# EAGLE design RH031.1 (EAGLE 7.1.0)
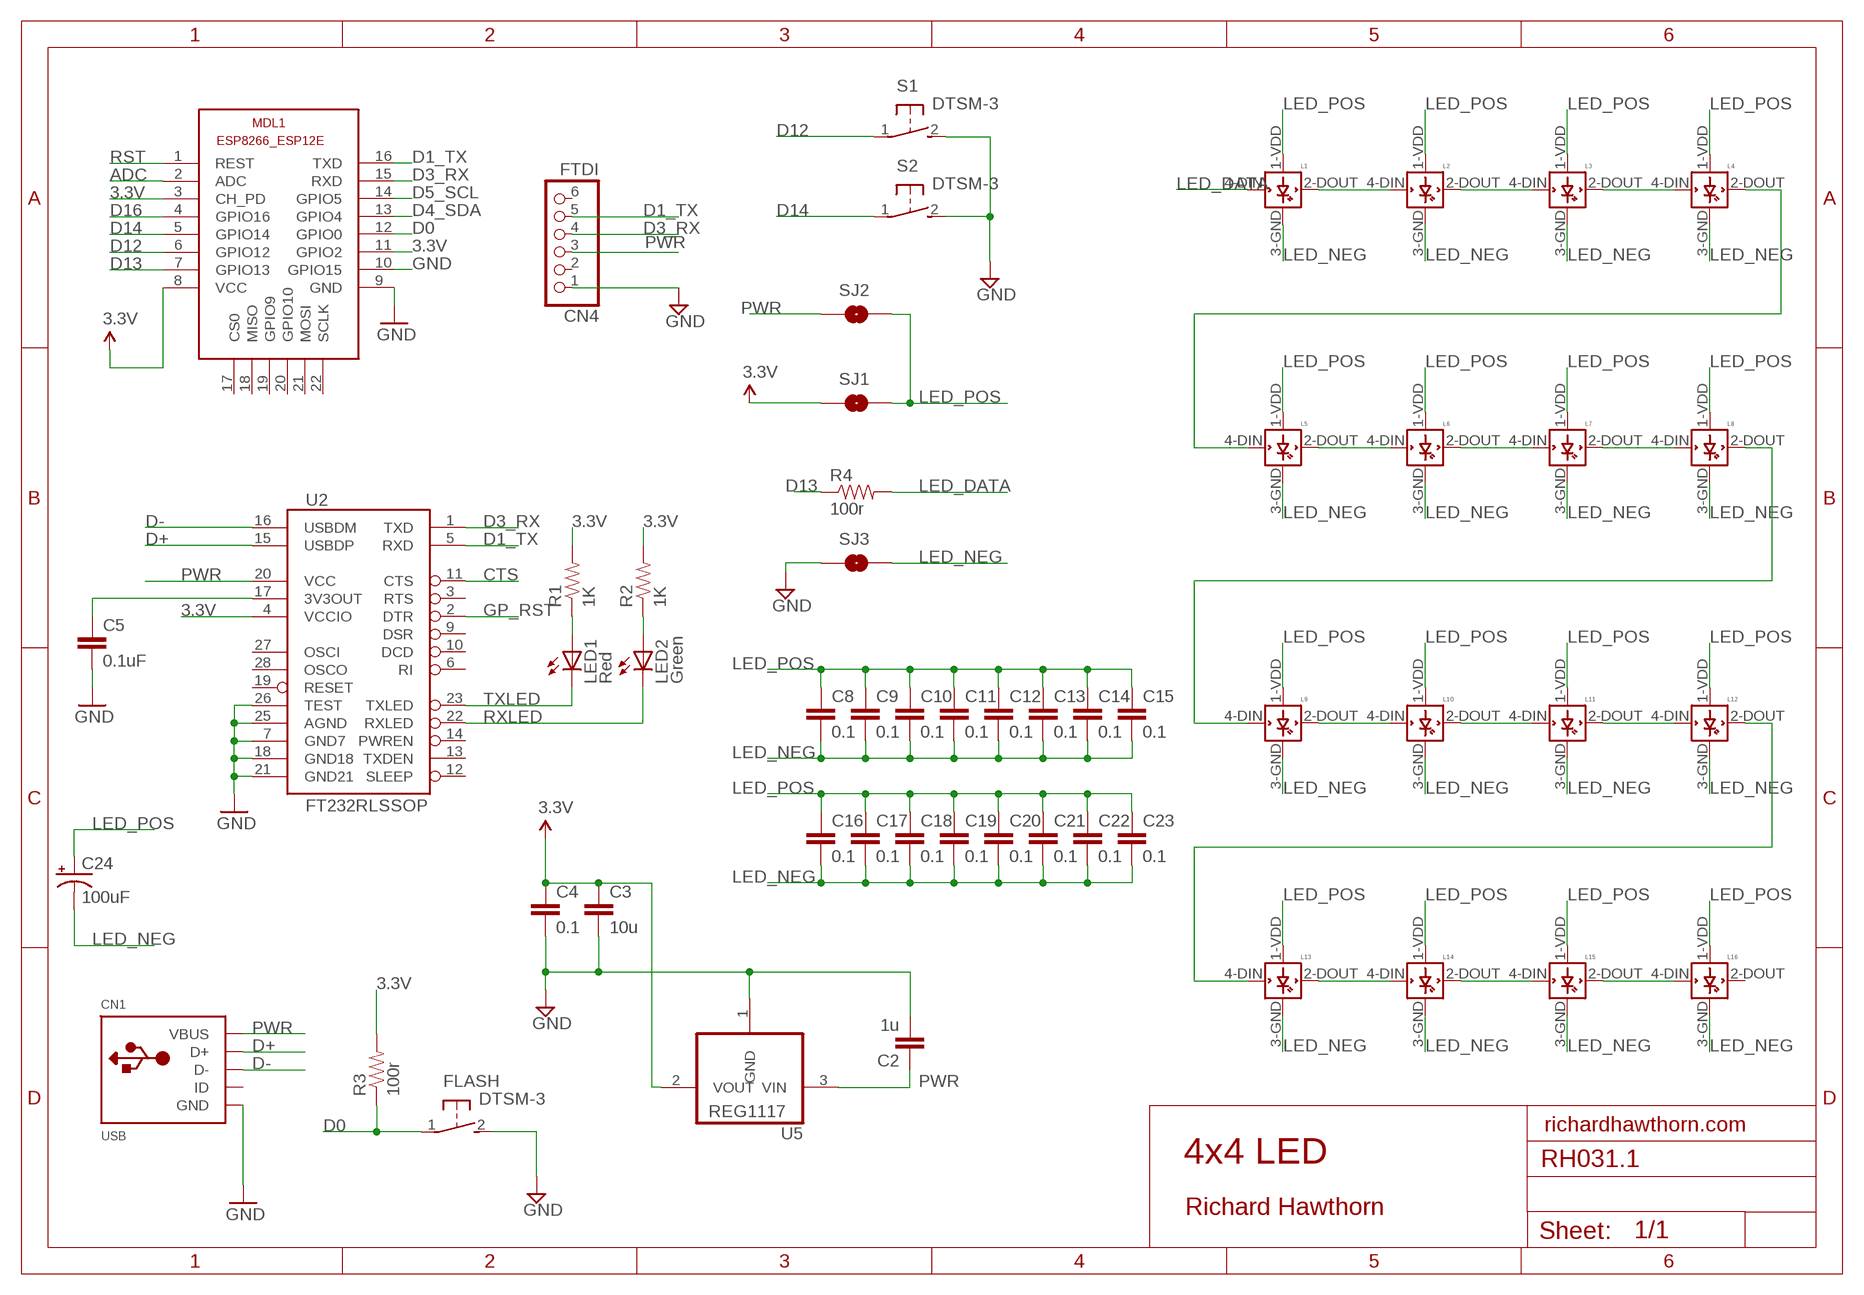
[diagram p0: schematic, sheet 1]

## Parts
C2  1u  CAP0603-CAP  [0603-CAP]
C3  10u  CAP0805-CAP  [0805-CAP]
C4  0.1  CAP0603-CAP  [0603-CAP]
C5  0.1uF  CAP0805  [0805]
C8  0.1  CAP0603-CAP  [0603-CAP]
C9  0.1  CAP0603-CAP  [0603-CAP]
C10  0.1  CAP0603-CAP  [0603-CAP]
C11  0.1  CAP0603-CAP  [0603-CAP]
C12  0.1  CAP0603-CAP  [0603-CAP]
C13  0.1  CAP0603-CAP  [0603-CAP]
C14  0.1  CAP0603-CAP  [0603-CAP]
C15  0.1  CAP0603-CAP  [0603-CAP]
C16  0.1  CAP0603-CAP  [0603-CAP]
C17  0.1  CAP0603-CAP  [0603-CAP]
C18  0.1  CAP0603-CAP  [0603-CAP]
C19  0.1  CAP0603-CAP  [0603-CAP]
C20  0.1  CAP0603-CAP  [0603-CAP]
C21  0.1  CAP0603-CAP  [0603-CAP]
C22  0.1  CAP0603-CAP  [0603-CAP]
C23  0.1  CAP0603-CAP  [0603-CAP]
C24  100uF  100UF-10V-10%(TANT)  [EIA7343]
CN1  USB  USBMINIB  [USB-MINIB]
CN4  FTDI  PINHD-1X6  [1X06]
FLASH  DTSM-3  [DTSM-3]
L1  WS2812B  [WS2812B]
L2  WS2812B  [WS2812B]
L3  WS2812B  [WS2812B]
L4  WS2812B  [WS2812B]
L5  WS2812B  [WS2812B]
L6  WS2812B  [WS2812B]
L7  WS2812B  [WS2812B]
L8  WS2812B  [WS2812B]
L9  WS2812B  [WS2812B]
L10  WS2812B  [WS2812B]
L11  WS2812B  [WS2812B]
L12  WS2812B  [WS2812B]
L13  WS2812B  [WS2812B]
L14  WS2812B  [WS2812B]
L15  WS2812B  [WS2812B]
L16  WS2812B  [WS2812B]
LED1  Red  LEDCHIPLED_0805  [CHIPLED_0805]
LED2  Green  LEDCHIPLED_0805  [CHIPLED_0805]
MDL1  ESP8266-12EESP8266-ESP12E  [ESP8266-ESP12E]
R1  1K  RESISTOR0805-RES  [0805]
R2  1K  RESISTOR0805-RES  [0805]
R3  100r  RESISTOR0603-RES  [0603-RES]
R4  100r  RESISTOR0603-RES  [0603-RES]
S1  DTSM-3  [DTSM-3]
S2  DTSM-3  [DTSM-3]
SJ1  SOLDERJUMPERNO  [SJ_2S-NO]
SJ2  SOLDERJUMPERNO  [SJ_2S-NO]
SJ3  SOLDERJUMPERNO  [SJ_2S-NO]
U2  FT232RLSSOP  [SSOP28DB]
U5  REG1117  [SOT223]

## Nets
3.3V: C3.1 C4.1 MDL1.3(CH_PD) MDL1.8(VCC) MDL1.11(GPIO2) R1.2 R2.2 R3.2 SJ1.1 U2.4(VCCIO) U5.2(VOUT)
3.3VOUT: C5.1 U2.17(3V3OUT)
ADC: MDL1.2(ADC)
CTS: U2.11(CTS)
D0: FLASH.1 MDL1.12(GPIO0) R3.1
D1_TX: CN4.5 MDL1.16(TXD) U2.5(RXD)
D3_RX: CN4.4 MDL1.15(RXD) U2.1(TXD)
D4_SDA: MDL1.13(GPIO4)
D5_SCL: MDL1.14(GPIO5)
D12: MDL1.6(GPIO12) S1.1
D13: MDL1.7(GPIO13) R4.1
D14: MDL1.5(GPIO14) S2.1
D16: MDL1.4(GPIO16)
D+: CN1.D+ U2.15(USBDP)
D-: CN1.D- U2.16(USBDM)
GND [power]: C2.2 C3.2 C4.2 C5.2 CN1.GND CN4.1 FLASH.2 MDL1.9(GND) MDL1.10(GPIO15) S1.2 S2.2 SJ3.1 U2.7(GND7) U2.18(GND18) U2.21(GND21) U2.25(AGND) U2.26(TEST) U5.1(GND)
GP_RST: U2.2(DTR)
LED-MID-1: L5.2-DOUT(DOUT) L6.4-DIN(DIN)
LED-MID-2: L7.2-DOUT(DOUT) L8.4-DIN(DIN)
LED-MID-3: L9.2-DOUT(DOUT) L10.4-DIN(DIN)
LED-OUT-1: L1.2-DOUT(DOUT) L2.4-DIN(DIN)
LED-OUT-2: L3.2-DOUT(DOUT) L4.4-DIN(DIN)
LED-OUT-3: L4.2-DOUT(DOUT) L5.4-DIN(DIN)
LED-OUT-4: L12.2-DOUT(DOUT) L13.4-DIN(DIN)
LED-OUT-5: L13.2-DOUT(DOUT) L14.4-DIN(DIN)
LED-OUT-6: L15.2-DOUT(DOUT) L16.4-DIN(DIN)
LED_DATA: L1.4-DIN(DIN) R4.2
LED_NEG [power]: C8.2 C9.2 C10.2 C11.2 C12.2 C13.2 C14.2 C15.2 C16.2 C17.2 C18.2 C19.2 C20.2 C21.2 C22.2 C23.2 C24.C(-) L1.3-GND(GND) L2.3-GND(GND) L3.3-GND(GND) L4.3-GND(GND) L5.3-GND(GND) L6.3-GND(GND) L7.3-GND(GND) L8.3-GND(GND) L9.3-GND(GND) L10.3-GND(GND) L11.3-GND(GND) L12.3-GND(GND) L13.3-GND(GND) L14.3-GND(GND) L15.3-GND(GND) L16.3-GND(GND) SJ3.2
LED_POS [power]: C8.1 C9.1 C10.1 C11.1 C12.1 C13.1 C14.1 C15.1 C16.1 C17.1 C18.1 C19.1 C20.1 C21.1 C22.1 C23.1 C24.A(+) L1.1-VDD(VDD) L2.1-VDD(VDD) L3.1-VDD(VDD) L4.1-VDD(VDD) L5.1-VDD(VDD) L6.1-VDD(VDD) L7.1-VDD(VDD) L8.1-VDD(VDD) L9.1-VDD(VDD) L10.1-VDD(VDD) L11.1-VDD(VDD) L12.1-VDD(VDD) L13.1-VDD(VDD) L14.1-VDD(VDD) L15.1-VDD(VDD) L16.1-VDD(VDD) SJ1.2 SJ2.2
N$2: LED1.A R1.1
N$3: LED2.A R2.1
N$6: L2.2-DOUT(DOUT) L3.4-DIN(DIN)
N$10: L6.2-DOUT(DOUT) L7.4-DIN(DIN)
N$12: L8.2-DOUT(DOUT) L9.4-DIN(DIN)
N$14: L10.2-DOUT(DOUT) L11.4-DIN(DIN)
N$15: L11.2-DOUT(DOUT) L12.4-DIN(DIN)
N$18: L14.2-DOUT(DOUT) L15.4-DIN(DIN)
PWR [power]: C2.1 CN1.VBUS CN4.3 SJ2.1 U2.20(VCC) U5.3(VIN)
RST: MDL1.1(REST)
RXLED: LED2.C U2.22(RXLED)
TXLED: LED1.C U2.23(TXLED)
Unconnected: CN1.ID CN4.2 CN4.6 L16.2-DOUT(DOUT) MDL1.17(CS0) MDL1.18(MISO) MDL1.19(GPIO9) MDL1.20(GPIO10) MDL1.21(MOSI) MDL1.22(SCLK) U2.3(RTS) U2.6(RI) U2.9(DSR) U2.10(DCD) U2.12(SLEEP) U2.13(TXDEN) U2.14(PWREN) U2.19(RESET) U2.27(OSCI) U2.28(OSCO)

## Notes on the sheet
- richardhawthorn.com
- 4x4 LED
- Richard Hawthorn

## Library data of the parts
C2-C4 C8-C23 = LowPowerLab:CAP: Capacitor Standard 0603 ceramic capacitor, and 0.1" leaded capacitor.
C5 = SparkFun:CAP: Capacitor Standard 0603 ceramic capacitor, and 0.1" leaded capacitor.
C24 = SparkFun-Capacitors:100UF-10V-10%(TANT): CAP-07890; PROD_ID: CAP-07890
CN1 = LowPowerLab:USB: USB Connectors USBMINIB - Surface Mount Female Mini-B USB Connector 4UConnector: 06564 By microbuilder.eu Thru-hole RA Female Mini-B USB Connector 4UConnector: 18732 By ladyada.net
CN4 = pinhead:PINHD-1X6: PIN HEADER
FLASH S1 S2 = switch-tact:DTSM-3
L1-L16 = adafruit:WS2812B
LED1 LED2 = led:LED: LED OSRAM: - CHIPLED LG R971, LG N971, LY N971, LG Q971, LY Q971, LO R971, LY R971 LH N974, LH R974 LS Q976, LO Q976, LY Q976 LO Q996 - Hyper CHIPLED LW Q18S LB Q993, LB Q99A, LB R99A - SideLED LS A670, LO A670, LY A670, LG A670, LP A670 LB A673, LV A673, LT A673, LW A673 LH A674 LY A675 LS A676, LA A676, LO A676, LY A676, LW A676 LS A679, LY A679, LG A679 - Hyper Micro SIDELED® LS Y876, LA Y876, LO Y876, LY Y876 LT Y87S - SmartLED LW L88C, LW L88S LB L89C, LB L89S, LG L890 LS L89K, LO L89K, LY L89K LS L896, LA L896, LO L896, LY L896 - TOPLED LS T670, LO T670, LY T670, LG T670, LP T670 LSG T670, LSP T670, LSY T670, LOP T670, LYG T670 LG T671, LOG T671, LSG T671 LB T673, LV T673, LT T673, LW T673 LH T674 LS T676, LA T676, LO T676, LY T676, LB T676, LH T676, LSB T676, LW T676 LB T67C, LV T67C, LT T67C, LS T67K, LO T67K, LY T67K, LW E67C LS E67B, LA E67B, LO E67B, LY E67B, LB E67C, LV E67C, LT E67C LW T67C LS T679, LY T679, LG T679 LS T770, LO T770, LY T770, LG T770, LP T770 LB T773, LV T773, LT T773, LW T773 LH T774 LS E675, LA E675, LY E675, LS T675 LS T776, LA T776, LO T776, LY T776, LB T776 LHGB T686 LT T68C, LB T68C - Hyper Mini TOPLED® LB M676 - Mini TOPLED Santana® LG M470 LS M47K, LO M47K, LY M47K Source: http://www.osram.convergy.de LUXEON: - LUMILED® LXK2-PW12-R00, LXK2-PW12-S00, LXK2-PW14-U00, LXK2-PW14-V00 LXK2-PM12-R00, LXK2-PM12-S00, LXK2-PM14-U00 LXK2-PE12-Q00, LXK2-PE12-R00, LXK2-PE12-S00, LXK2-PE14-T00, LXK2-PE14-U00 LXK2-PB12-K00, LXK2-PB12-L00, LXK2-PB12-M00, LXK2-PB14-N00, LXK2-PB14-P00, LXK2-PB14-Q00 LXK2-PR12-L00, LXK2-PR12-M00, LXK2-PR14-Q00, LXK2-PR14-R00 LXK2-PD12-Q00, LXK2-PD12-R00, LXK2-PD12-S00 LXK2-PH12-R00, LXK2-PH12-S00 LXK2-PL12-P00, LXK2-PL12-Q00, LXK2-PL12-R00 Source: www.luxeon.com KINGBRIGHT: KA-3528ASYC Source: www.kingbright.com
MDL1 = ESP8266-ESP12E:ESP8266-12E: ESP8266-12E with additional I/O and GPIO04/05 corrected The author cannot warrant that this library is free from error or will meet your specific requirements. Created by PuceBaboon.com. Komagane, Nagano, JAPAN
R1 R2 = SparkFun:RESISTOR: Resistor Basic schematic elements and footprints for 0603, 1206, and PTH resistors.
R3 R4 = LowPowerLab:RESISTOR: Resistor Basic schematic elements and footprints for 0603, 1206, and PTH resistors.
SJ1-SJ3 = SparkFun-Retired:SOLDERJUMPER: Solder Jumper Standard SMD solder jumper. Used to automate production. Two varients : Normally Open and Normally Closed are the same, but have different paste layers. NC will have a large amount of paste and should jumper during reflow.
U2 = SparkFun:FT232RL: USB UART FT232RL 4th Generation USB UART (USB <-> Serial) Controller. Spark Fun Electronics SKU : COM-00650
U5 = burr-brown:REG1117: 800mA and 1A Low Dropout (LDO) Positive Regulator 1.8V, 2.5V, 2.85V, 3.3V, 5V, and Adj; MPN: REG1117; OC_FARNELL: 1097566; OC_NEWARK: 14P6981

## Net classes
1 power: width 0.381 mm, clearance 0.254 mm

## Board
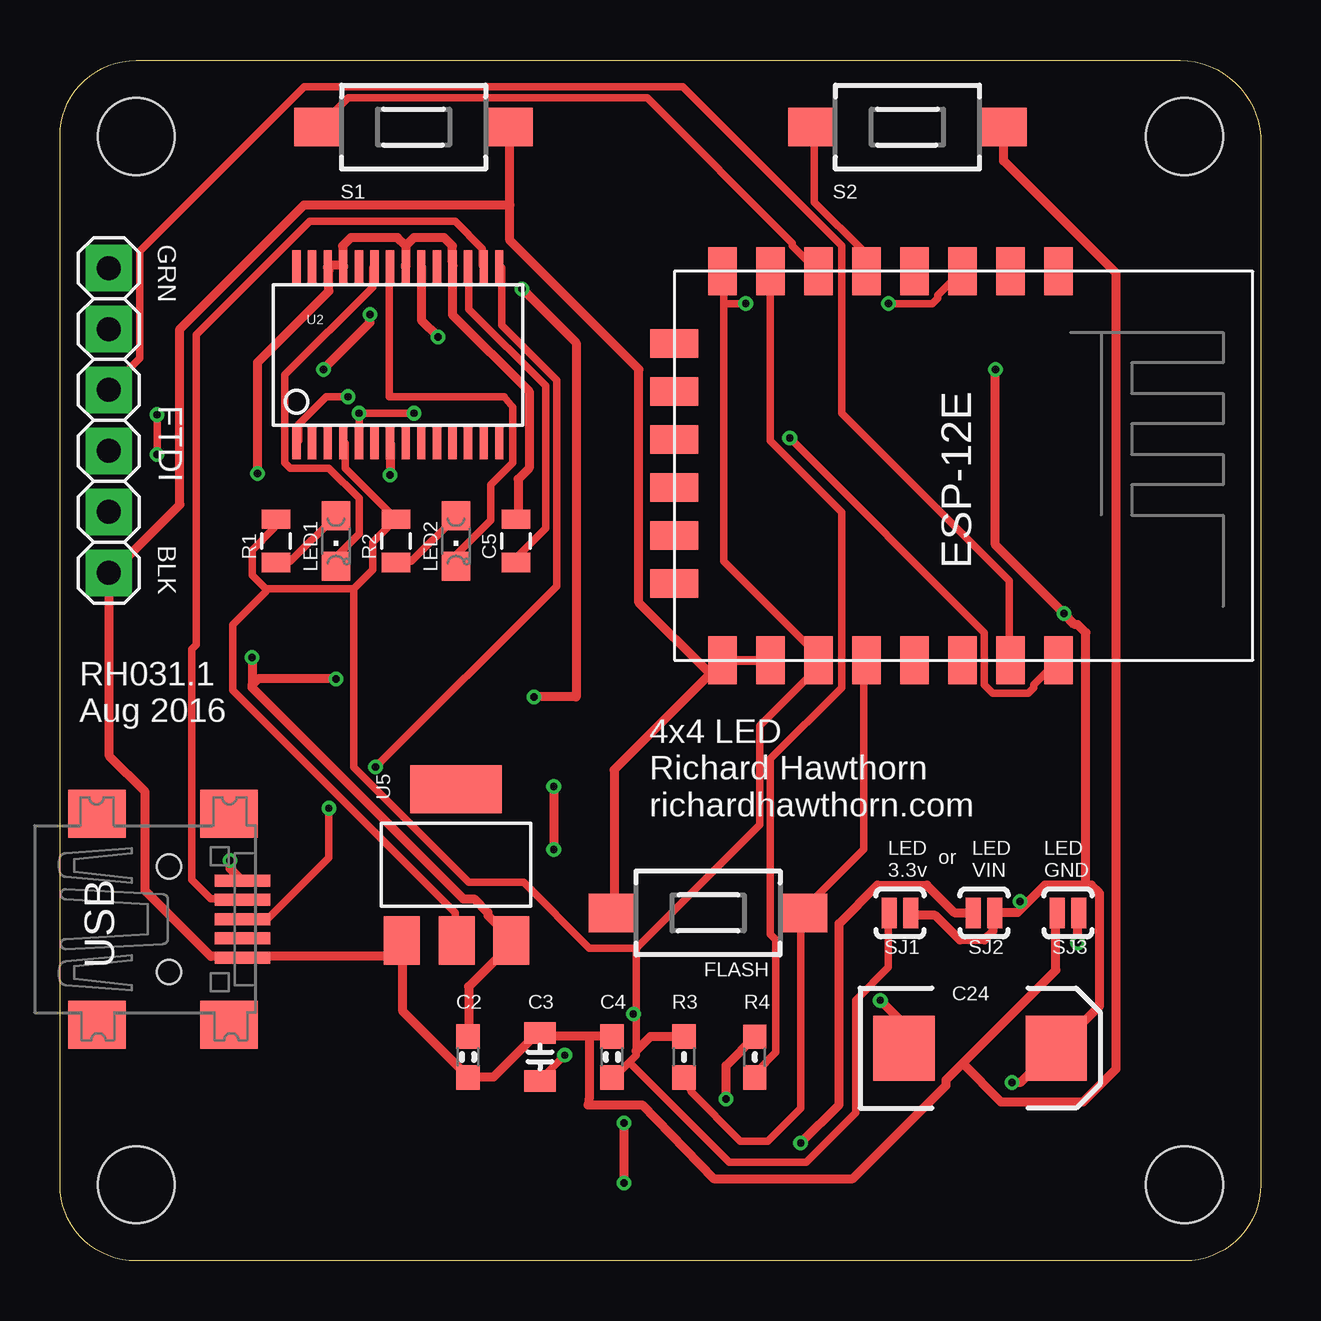
[diagram p1: board, top side]
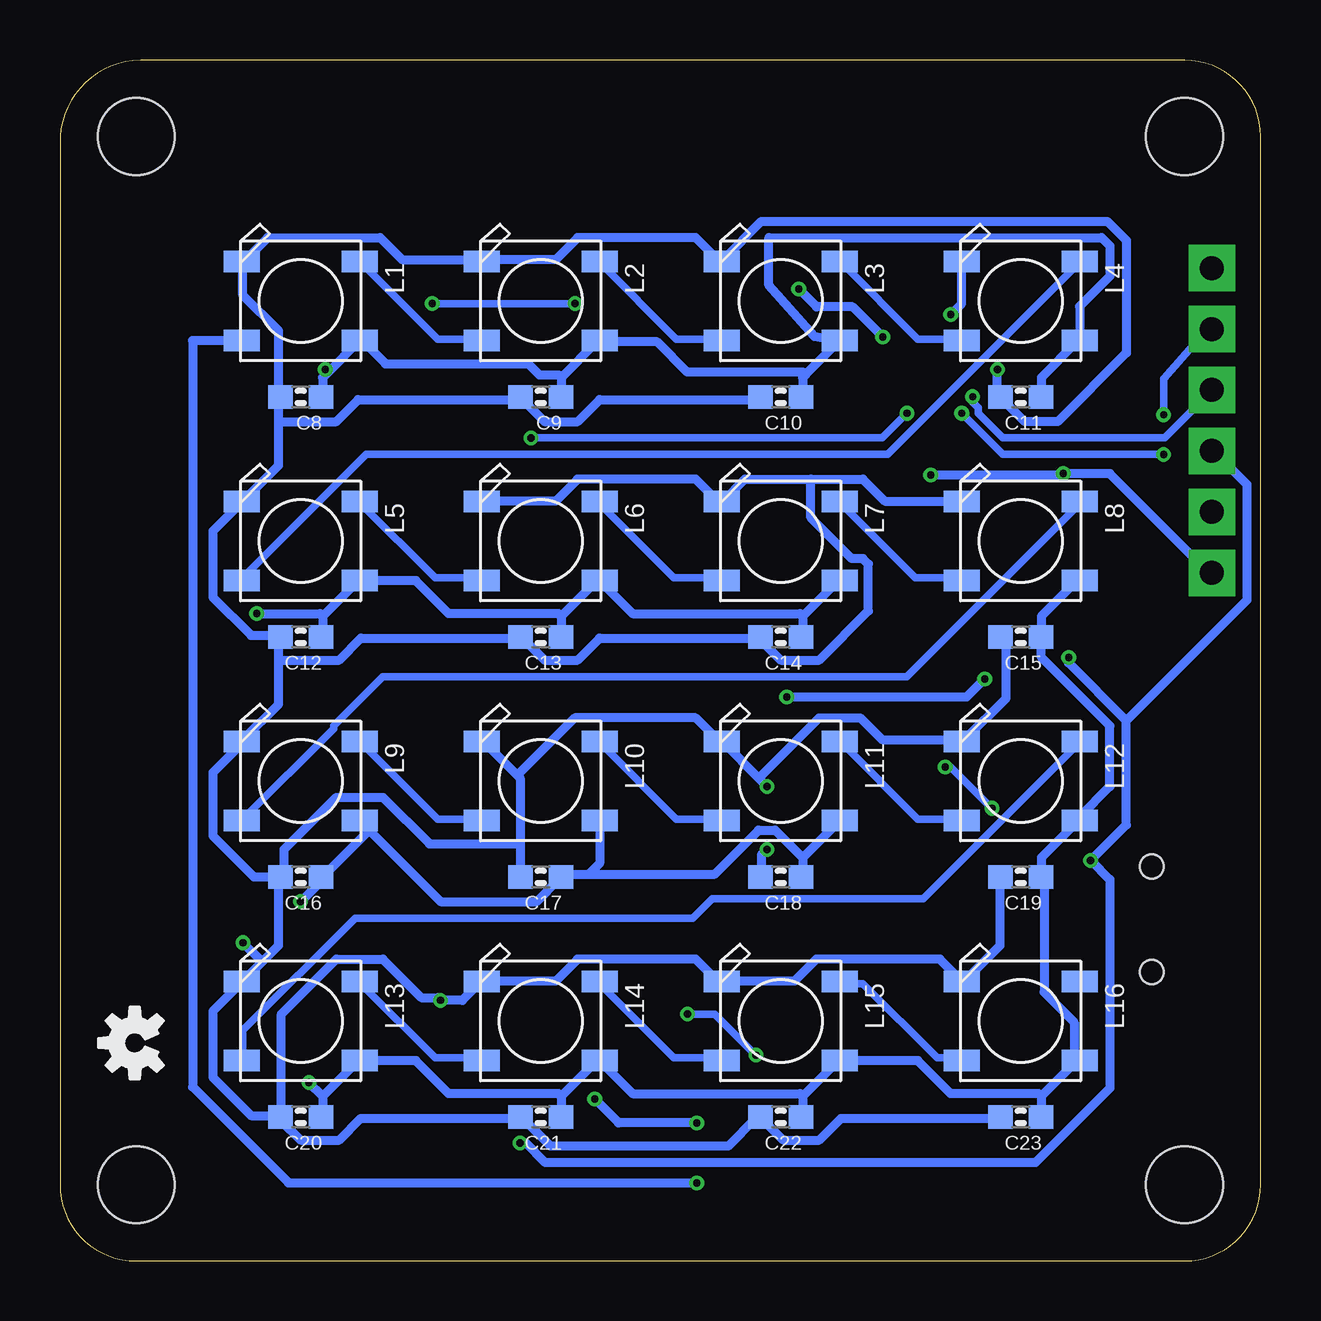
[diagram p2: board, bottom side, seen from below]

Size 50.03 x 50.04 mm. Coordinates in mm from the lower left corner, seen from the top.
Outline: 46.85,0 3.17,0 arc-90 0,3.17 0,46.85 arc-90 3.17,50.03 46.35,50.03 arc-90 50.03,46.85 50.03,3.17 arc-90 46.85,0
Copper layers (1*16): Top 0.035mm / dielectric 1.5mm / Bottom 0.035mm
Design rules "ITEADstudio_DRC *": minimum track width 12mil, minimum drill 12mil, track to track 6mil, track to pad 6mil, pad to pad 6mil, via to via 6mil, smd to smd 0mil, copper to edge 10mil, drill to drill 10mil, minimum pad ring 10mil, minimum via ring 6mil, stop-mask expansion 2mil, vias tented up to drill 100mil, thermal gap 15mil
Holes 3.2 mm at 3.17,3.17 46.85,3.17 3.17,46.85 46.85,46.85
tKeepout: area 0,44.3 to 5.7,50; area 44.3,25 to 50,50; area 44.3,0 to 50,5.7; area 0,0 to 5.7,5.7
bKeepout: area 0,0 to 5.7,5.7; area 0,44.3 to 5.7,50; area 44.3,25 to 50,50; area 44.3,0 to 50,5.7
tRestrict: area 24.3,8.9 to 29.1,12.8; area 5.8,16.9 to 6.9,18.5; area 5.2,9.7 to 6.7,10.4
bRestrict: area 27.4,17.7 to 29.2,18.7; area 21.1,13.8 to 22.9,14.9; area 21.6,12.6 to 22.1,13.2; area 20.7,12.6 to 21.2,13.2; area 20.2,12.8 to 20.7,13.5; area 20.1,13.4 to 20.6,14; area 26.5,18.9 to 27.1,19.5; area 26.5,17.9 to 27.1,18.5; area 27.5,19.1 to 28,19.8; area 27.9,18.8 to 29.1,19.6

### Footprints (pad centres in the part's own frame; a part is rotated, then mirrored left to right if it is on the bottom)
0603-CAP = smd 1.016 x 0.965: 1 -0.85,0; 2 0.85,0
0805-CAP = smd 0.902 x 1.3: 1 -1,0; 2 1,0
0805 = smd 0.8 x 1.2: 1 -0.9,0; 2 0.9,0
EIA7343 = smd 2.55 x 2.7: A 3.17,0; C -3.17,0
USB-MINIB = smd 0.5 x 2.308: D+ 0,4.064; D- -0.8,4.064; GND 1.6,4.064; ID 0.8,4.064; VBUS -1.6,4.064 | smd 2 x 2.4: GND1 -4.4,-2; GND2 -4.4,3.5; GND3 4.4,3.5; GND4 4.4,-2 | hole 1: -2.2,1; 2.2,1
1X06 = drill 1 pad 1.93 square: 1 -6.35,0; 2 -3.81,0; 3 -1.27,0; 4 1.27,0; 5 3.81,0; 6 6.35,0
DTSM-3 = smd 2 x 1.6: 1 -3.97,0; 2 3.97,0
WS2812B = smd 1.5 x 0.9: 1-VDD 2.45,-1.65; 2-DOUT 2.45,1.65; 3-GND -2.45,1.65; 4-DIN -2.45,-1.65
CHIPLED_0805 = smd 1.2 x 1.2: A 0,-1.05; C 0,1.05
ESP8266-ESP12E = smd 2 x 1.2: 1 0,16; 2 0,14; 3 0,12; 4 0,10; 5 0,8; 6 0,6; 7 0,4; 8 0,2; 9 16.2,2; 10 16.2,4; 11 16.2,6; 12 16.2,8; 13 16.2,10; 14 16.2,12; 15 16.2,14; 16 16.2,16 | smd 1.2 x 2: 17 11,0; 18 3,0; 19 5,0; 20 13,0; 21 7,0; 22 9,0
0603-RES = smd 1.016 x 0.965: 1 -0.85,0; 2 0.85,0
SJ_2S-NO = smd 0.635 x 1.27: 1 -0.45,0; 2 0.45,0
SSOP28DB = smd 0.348 x 1.397: 1 -4.225,-3.656; 2 -3.575,-3.656; 3 -2.925,-3.656; 4 -2.275,-3.656; 5 -1.625,-3.656; 6 -0.975,-3.656; 7 -0.325,-3.656; 8 0.325,-3.656; 9 0.975,-3.656; 10 1.625,-3.656; 11 2.275,-3.656; 12 2.925,-3.656; 13 3.575,-3.656; 14 4.225,-3.656; 15 4.225,3.656; 16 3.575,3.656; 17 2.925,3.656; 18 2.275,3.656; 19 1.625,3.656; 20 0.975,3.656; 21 0.325,3.656; 22 -0.325,3.656; 23 -0.975,3.656; 24 -1.625,3.656; 25 -2.275,3.656; 26 -2.925,3.656; 27 -3.575,3.656; 28 -4.225,3.656
SOT223 = smd 1.499 x 2.007: 1 -2.261,-3.15; 2 0.025,-3.15; 3 2.311,-3.15 | smd 3.81 x 2.007: 4 0,3.15

### Placement (x,y rotation side)
C2  17,8.5 270 top
C3  20,8.5 90 top
C4  23,8.5 90 top
C5  19,30 90 top
C8  40,36 180 bottom
C9  30,36 180 bottom
C10  20,36 180 bottom
C11  10,36 180 bottom
C12  40,26 180 bottom
C13  30,26 180 bottom
C14  20,26 180 bottom
C15  10,26 180 bottom
C16  40,16 180 bottom
C17  30,16 180 bottom
C18  20,16 180 bottom
C19  10,16 180 bottom
C20  40,6 180 bottom
C21  30,6 180 bottom
C22  20,6 180 bottom
C23  10,6 180 bottom
C24  38.34,8.86 0 top
CN1  3.54,14.24 270 top
CN4  2.03,35.02 90 top
FLASH  27,14.5 180 top
L1  40,40 0 bottom
L2  30,40 0 bottom
L3  20,40 0 bottom
L4  10,40 0 bottom
L5  40,30 0 bottom
L6  30,30 0 bottom
L7  20,30 0 bottom
L8  10,30 0 bottom
L9  40,20 0 bottom
L10  30,20 0 bottom
L11  20,20 0 bottom
L12  10,20 0 bottom
L13  40,10 0 bottom
L14  30,10 0 bottom
L15  20,10 0 bottom
L16  10,10 0 bottom
LED1  11.5,30 180 top
LED2  16.5,30 180 top
MDL1  25.6,41.23 270 top
R1  9,30 90 top
R2  14,30 90 top
R3  26,8.5 90 top
R4  28.95,8.49 90 top
S1  14.73,47.24 0 top
S2  35.31,47.24 0 top
SJ1  35,14.5 0 top
SJ2  38.5,14.5 0 top
SJ3  42,14.5 0 top
U2  14.08,37.75 0 top
U5  16.5,16.5 0 top
U$3  [OSHW-LOGO-S]  46.92,9.08 90 bottom

### Tracks (layer width: path | path; a pad name or v marks a point on that pad's centre or on a via)
3.3V  (via drill 0.3)
  Top 0.305: 8.57,28 8,28.57 8,29.6 8.91,30.52 8.91,30.86 R1.2 | 12.23,28 8.57,28 | 12.23,28 13.03,28.8 13.03,29.95 13.95,30.86 R2.2 13.95,30.98 11.89,33.03 11.89,34.06 U2.4 | U5.2 16.46,13.37 16.46,14.52 7.2,23.77 7.2,26.52 8.57,27.89 8.57,28 | 23.72,8.29 24,8.57 24,8.75 24,10.29 | 23.72,8.29 23.09,7.66 C4.1 | 24,13.03 24,10.29 | 24,13.03 29.15,18.17 29.15,22.29 31.55,24.69 31.55,24.92 MDL1.11 31.66,25.15 27.66,29.15 27.66,39.89 | 23.72,8.29 27.89,4.12 31.09,4.12 33.15,6.17 33.15,10.86 34.52,12.23 34.52,14.4 SJ1.1 | v21.03,8.57 20,7.54 C3.1 | v23.89,10.29 24,10.29 | 27.66,39.89 27.66,41.15 MDL1.8 | v34.52,39.89 36.35,39.89 36.58,40.12 36.58,40.23 37.49,41.15 MDL1.3 | 27.66,39.89 v28.57,39.89 | 12.23,28 12.23,20.57 17.03,15.77 19.32,15.77 22.06,13.03 24,13.03
  Top 0.381: R3.2 24.6,9.35 24,8.75
  Bottom 0.305: v21.03,8.57 22.75,10.29 v23.89,10.29 | v28.57,39.89 v34.52,39.89
3.3VOUT
  Top 0.305: C5.1 19.09,29.15 19.09,29.38 20.23,30.52 20.23,36.46 17.03,39.66 17.03,41.38 U2.17
D0
  Top 0.305: R3.1 26.06,7.54 26.3,7.04 28.35,4.99 29.49,4.99 30.86,6.37 30.86,14.4 FLASH.1 30.98,14.63 33.49,17.14 33.49,24.92 MDL1.12
D1_TX  (via drill 0.3)
  Top 0.305: v4.04,35.26 v4.04,33.6 | U2.5 12.46,34.18 v12.46,35.32 v14.74,35.32 | v30.4,34.29 38.52,26.18 38.52,24 38.86,23.66 40.35,23.66 40.58,23.89 40.58,24 41.49,24.92 MDL1.16
  Bottom 0.305: v12.46,35.32 10.74,33.6 v4.04,33.6 | v4.04,35.26 4.04,36.76 2.06,39 CN4.5 | v30.4,34.29 15.77,34.29 v14.74,35.32
D3_RX  (via drill 0.3)
  Top 0.305: v12,36.01 11.09,36.01 9.94,34.86 9.94,34.18 U2.1 | MDL1.15 39.55,25.03 39.55,28.35 32.58,35.32 32.58,42.29 25.95,48.92 10.17,48.92 3.31,42.06 3.31,37.6 2.06,36.35 CN4.4
  Bottom 0.305: v12,36.01 12,35.78 11.77,35.55 11.77,35.32 10.74,34.29 4,34.29 2.06,36.23 CN4.4
D12
  Top 0.305: MDL1.6 31.55,41.26 30.52,42.29 30.52,42.41 24.46,48.46 12,48.46 10.86,47.32 S1.1
D13
  Top 0.305: R4.1 29.03,7.66 29.03,7.89 29.83,8.69 29.83,13.37 29.6,13.6 29.6,20.92 32.58,23.89 32.58,31.2 29.6,34.18 29.6,41.15 MDL1.7
D14
  Top 0.305: S2.1 31.43,47.21 31.43,44.12 33.49,42.06 33.49,41.26 MDL1.5
D+  (via drill 0.3)
  Top 0.305: v13.14,20.57 20.69,28.12 20.69,36.69 18.4,38.98 18.4,41.38 U2.15 | v11.2,18.86 11.2,16.8 8.69,14.29 7.66,14.29 CN1.D+
  Bottom 0.305: v13.14,20.57 12.92,20.57 v11.2,18.86
D-
  Top 0.305: U2.16 17.6,41.49 17.6,42.18 16.46,43.32 10.4,43.32 5.68,38.6 5.68,25.68 5.49,25.49 5.49,15.89 6.29,15.09 7.54,15.09 CN1.D-
GND  (via drill 0.3)
  Top 0.381: 27.09,24.46 27.55,24.92 MDL1.9 27.77,25.03 29.49,25.03 MDL1.10 | 27.09,24.46 23.09,20.46 23.09,14.52 FLASH.2 | 18.75,44.01 18.75,42.52 24.12,37.15 24.12,27.43 27.09,24.46 | 18.75,44.01 18.75,47.21 S1.2 | C5.2 19.09,30.98 19.09,32.58 19.55,33.03 19.55,36.23 16.34,39.43 16.34,41.38 U2.18 16.34,41.6 16.34,42.29 16,42.63 14.74,42.63 14.4,42.29 | 14.4,42.29 14.4,41.49 U2.21 | 14.4,42.29 14.06,42.63 12.12,42.63 11.77,42.29 11.77,41.6 U2.25 11.77,41.49 11.2,41.49 U2.26 11.2,41.26 11.2,40.41 8.23,37.44 v8.23,32.8 | 22.06,9.37 20.12,9.37 C3.2 19.89,9.49 18.06,7.66 17.03,7.66 C2.2 16.92,7.77 14.29,10.4 14.29,13.26 U5.1 14.17,12.69 7.66,12.69 CN1.GND 7.43,12.69 6.29,12.69 3.54,15.43 3.54,19.55 2.06,21.03 2.06,28.57 CN4.1 2.17,28.69 4.99,31.51 4.99,38.83 10.17,44.01 18.75,44.01 | 22.06,9.37 22.97,9.37 C4.2 | 37.6,8.23 36.92,7.54 36.92,7.32 33.03,3.43 27.24,3.43 24.25,6.5 22,6.5 22.06,6.86 22.06,9.37 | 37.6,8.23 41.49,12.12 41.49,14.4 SJ3.1 | 37.6,8.23 39.2,6.63 42.63,6.63 44.01,8 44.01,41.15 39.32,45.83 39.32,47.21 S2.2 | U2.7 v13.75,32.75
  Bottom 0.381: CN4.1 2.06,28.57 6.29,32.8 v8.23,32.8 8.23,32.75 v13.75,32.75
LED-MID-1
  Bottom 0.305: L6.4-DIN 32.46,28.46 34.4,28.46 37.49,31.55 L5.2-DOUT
LED-MID-2
  Bottom 0.305: L8.4-DIN 12.46,28.46 14.4,28.46 17.49,31.55 L7.2-DOUT
LED-MID-3
  Bottom 0.305: L10.4-DIN 32.46,18.4 34.29,18.4 37.49,21.6 L9.2-DOUT
LED-OUT-1
  Bottom 0.305: L2.4-DIN 32.46,38.41 34.29,38.41 37.49,41.6 L1.2-DOUT
LED-OUT-2
  Bottom 0.305: L4.4-DIN 12.46,38.41 14.29,38.41 17.49,41.6 L3.2-DOUT
LED-OUT-3
  Bottom 0.305: L5.4-DIN 42.41,28.46 37.26,33.6 15.54,33.6 7.54,41.6 L4.2-DOUT
LED-OUT-4
  Bottom 0.305: L13.4-DIN 42.41,8.46 42.41,9.6 37.72,14.29 23.66,14.29 22.86,15.09 14.06,15.09 7.54,21.6 L12.2-DOUT
LED-OUT-5
  Bottom 0.305: L14.4-DIN 32.46,8.46 34.4,8.46 37.49,11.54 L13.2-DOUT
LED-OUT-6
  Bottom 0.305: L16.4-DIN 12.46,8.46 13.49,8.46 16.57,11.54 17.49,11.54 L15.2-DOUT
LED_DATA  (via drill 0.3)
  Top 0.381: v23.5,3.25 v23.5,5.75 | v27.75,6.75 27.75,8.14 R4.2
  Bottom 0.381: L1.4-DIN 44.5,38.35 44.5,7.25 40.5,3.25 v23.5,3.25 | v23.5,5.75 26.75,5.75 v27.75,6.75
LED_NEG  (via drill 0.3)
  Top 0.381: v34.18,10.86 35.09,9.94 35.09,8.91 C24.C | v12.92,39.43 12.92,39.09 v10.97,37.15 | v20.57,19.77 v20.57,17.14 | v42.41,13.26 42.41,14.4 SJ3.2
  Bottom 0.381: C19.2 10.86,15.89 10.86,13.14 12.34,11.66 L16.3-GND 12.57,11.77 13.37,12.57 18.52,12.57 19.43,11.66 22.4,11.66 L15.3-GND 22.63,11.66 23.55,12.57 28.46,12.57 29.38,11.66 32.35,11.66 L14.3-GND 32.58,11.54 33.26,10.86 v34.18,10.86 34.29,10.97 34.98,10.97 36.58,12.57 38.52,12.57 40.8,10.29 40.8,6.17 C20.2 | v12.92,39.43 12.46,39.89 12.46,41.6 L4.3-GND | v10.97,37.15 10.97,36.12 C11.2 10.74,35.89 9.83,34.98 8.46,34.98 5.6,37.83 5.6,42.52 6.4,43.32 20.8,43.32 22.4,41.72 L3.3-GND 22.63,41.72 23.55,42.63 28.46,42.63 29.38,41.72 32.35,41.72 L2.3-GND 32.58,41.72 35.78,41.72 36.69,42.63 41.38,42.63 42.29,41.72 L1.3-GND 42.41,41.6 42.41,40.23 40.92,38.75 40.92,36.12 C8.2 40.92,35.89 40.92,34.98 | 30.86,17.37 30.86,20.12 30.98,20.23 | 30.86,17.37 30.86,16 C17.2 | 30.98,20.23 32.35,21.6 L10.3-GND | C15.2 10.61,26.2 10.61,23.45 12.34,21.72 L12.3-GND 12.57,21.72 15.77,21.72 16.69,22.63 18.4,22.63 20.92,20.12 | v20.57,17.14 20.8,16.92 20.8,16 C18.2 | 20.92,20.12 22.4,21.6 L11.3-GND 22.63,21.72 23.55,22.63 28.57,22.63 30.98,20.23 | 20.92,20.12 v20.57,19.77 | 18.75,32.58 21.49,32.58 22.4,31.66 L7.3-GND 22.63,31.66 23.55,32.58 28.46,32.58 29.38,31.66 32.35,31.66 L6.3-GND | 18.75,32.58 16.57,32.58 15.66,31.66 12.46,31.66 L8.3-GND | C23.2 10.86,5.94 17.49,5.94 18.4,5.03 19.89,5.03 20.8,5.94 C22.2 21.03,5.94 22.2,4.78 29.58,4.78 30.75,5.94 C21.2 30.98,5.94 37.49,5.94 38.41,5.03 40.01,5.03 40.8,5.83 C20.2 | C20.2 40.92,6.06 42.06,6.06 43.66,7.66 43.66,10.4 42.52,11.54 L13.3-GND 42.29,11.77 41.6,12.46 | 41.6,12.46 40.92,13.14 40.92,15.89 C16.2
  Bottom 0.381: 41.6,12.46 v42.41,13.26 | C10.2 20.92,35.89 27.55,35.89 28.46,34.98 29.83,34.98 30.75,35.89 C9.2 30.98,35.89 37.6,35.89 38.52,34.98 40.92,34.98 | 40.92,25.03 40.92,23.2 42.41,21.72 L9.3-GND 42.52,21.49 43.66,20.34 43.66,17.72 41.95,16 41.03,16 C16.2 | 40.92,25.03 40.92,25.95 C12.2 41.03,26.06 42.06,26.06 43.66,27.66 43.66,30.4 42.52,31.55 L5.3-GND 42.41,31.66 40.92,33.15 40.92,34.98 | 40.92,25.03 38.41,25.03 37.49,25.95 30.98,25.95 C13.2 30.75,25.95 29.83,25.03 28.46,25.03 27.55,25.95 20.92,25.95 C14.2 20.8,25.83 20,25.03 18.4,25.03 16.34,27.09 16.34,29.03 16.57,29.26 17.03,29.26 18.75,30.98 18.75,32.58 | 30.86,17.37 34.63,17.37 36.58,19.32 38.52,19.32 40.69,17.14 40.69,16.12 C16.2
LED_POS  (via drill 0.3)
  Top 0.381: SJ1.2 35.55,14.4 36.46,14.4 37.49,13.37 38.52,13.37 38.86,13.72 38.86,14.4 SJ2.2 39.09,14.52 39.89,14.52 40.23,14.86 | 40.23,14.86 41.03,15.66 42.75,15.66 | 42.75,15.66 42.98,15.66 43.32,15.32 43.32,10.63 41.6,8.91 C24.A 41.38,8.8 40.01,7.43 v39.66,7.43 | v40.01,14.97 40.12,14.97 40.23,14.86 | 42.75,15.66 42.75,26.18 42.41,26.52 42.29,26.52 v41.83,26.98 38.98,29.83 v38.98,37.15
  Bottom 0.381: 39.09,6.86 39.09,6.06 C20.1 | 39.09,6.86 37.6,8.34 L13.1-VDD 37.38,8.34 35.2,8.34 33.83,6.97 29.26,6.97 29.15,6.86 | 19.09,6.86 19.09,6.06 C22.1 | 19.09,6.86 17.6,8.34 L15.1-VDD 17.37,8.34 14.29,8.34 12.92,6.97 9.26,6.97 9.14,6.86 | 29.15,6.86 29.15,6.06 C21.1 | 29.15,6.86 27.66,8.34 L14.1-VDD 27.43,8.23 26.18,6.97 19.2,6.97 19.09,6.86 | L8.1-VDD 7.66,28.35 9.14,26.86 9.14,26.06 C15.1 9.14,25.83 9.14,25.15 6.29,22.29 6.29,19.77 7.54,18.52 L12.1-VDD 7.66,18.29 9.14,16.8 C19.1 9.03,15.89 9.03,11.2 7.77,9.94 7.77,8.46 L16.1-VDD 7.66,8.34 9.14,6.86 | 9.14,6.86 9.14,6.06 C23.1 | 29.15,36.8 C9.1 | 29.15,36.8 27.66,38.29 L2.1-VDD 27.43,38.29 25.15,38.29 23.89,37.03 19.09,37.03 18.97,36.92 | 38.86,37.03 37.6,38.29 L1.1-VDD 37.38,38.29 36.46,37.38 30.52,37.38 30.06,36.92 29.26,36.92 29.15,36.8 | 38.86,37.03 39.09,36.8 39.09,36.01 C8.1 | C11.1 9.14,36.8 7.66,38.29 L4.1-VDD 7.54,38.52 7.54,39.78 6.29,41.03 6.29,42.29 6.63,42.63 20.5,42.63 20.5,40.66 18.6,38.52 L3.1-VDD 17.6,38.29 18.97,36.92 | 18.97,36.92 19.09,36.8 19.09,36.01 C10.1 | 39.09,26.86 39.09,26.06 C12.1 | 39.09,26.86 37.6,28.35 L5.1-VDD 37.38,28.35 35.2,28.35 33.83,26.98 29.26,26.98 29.15,26.86 | 19.09,26.86 19.09,26.06 C14.1 | 19.09,26.86 17.6,28.35 L7.1-VDD | 29.15,26.86 29.15,26.06 C13.1 | 29.15,26.86 27.66,28.35 L6.1-VDD 27.43,28.23 26.18,26.98 19.2,26.98 19.09,26.86 | 19.09,16.8 19.09,16 C18.1 | 19.09,16.8 17.6,18.29 L11.1-VDD | 37.15,17.95 37.49,18.29 L9.1-VDD | 37.15,17.95 34.18,14.97 30.18,14.97 29.26,15.89 C17.1 29.03,16.12 28,16.12 | 37.15,17.95 39.09,16 C16.1 39.09,15.89 v40.01,14.97 | 19.09,16.8 20.23,17.95 20.92,17.95 22.75,16.12 28,16.12
  Bottom 0.381: v41.83,26.98 39.2,26.98 39.09,26.86 | v38.98,37.15 38.86,37.03 | v39.66,7.43 39.09,6.86 | L10.1-VDD 27.55,16.57 28,16.12
N$2
  Top 0.305: R1.1 9.03,29.15 9.6,29.15 11.43,30.98 LED1.A
N$3
  Top 0.305: R2.1 14.06,29.15 14.63,29.15 16.46,30.98 LED2.A
N$6
  Bottom 0.305: L3.4-DIN 22.52,38.41 24.35,38.41 27.55,41.6 L2.2-DOUT
N$10
  Bottom 0.305: L7.4-DIN 22.52,28.46 24.46,28.46 27.55,31.55 L6.2-DOUT
N$12
  Bottom 0.305: L9.4-DIN 42.41,18.4 38.63,22.17 38.63,22.29 36.58,24.35 14.74,24.35 7.54,31.55 L8.2-DOUT
N$14
  Bottom 0.305: L11.4-DIN 22.52,18.4 24.35,18.4 27.55,21.6 L10.2-DOUT
N$15
  Bottom 0.305: L12.4-DIN 12.46,18.4 14.29,18.4 17.49,21.6 L11.2-DOUT
N$18
  Bottom 0.305: L15.4-DIN 22.52,8.46 24.46,8.46 27.55,11.54 L14.2-DOUT
PWR  (via drill 0.3)
  Top 0.381: C2.1 17.03,9.37 17.03,11.43 18.86,13.26 U5.3 18.75,13.49 17.83,14.4 17.83,14.52 17.26,15.09 16.8,15.09 8,23.89 8,24 | v30.86,4.92 32.46,6.51 32.46,14.06 34.06,15.66 36.12,15.66 37.26,14.52 37.95,14.52 SJ2.1 | v7.09,16.69 7.09,16.34 7.54,15.89 CN1.VBUS | v8,25.15 8,24 | U2.20 15.05,39.2 v15.75,38.5 | v19.25,40.5 21.5,38.25 21.5,23.5 v19.75,23.5 | v11.5,24.25 8.25,24.25 8,24
  Bottom 0.381: v30.86,4.92 30.63,4.92 29.81,4.09 9.39,4.09 6.29,7.2 6.29,15.89 v7.09,16.69 5.6,18.17 5.6,22.52 | v8,25.15 8,24.92 5.6,22.52 | 5.6,22.52 0.57,27.55 0.57,32.35 1.94,33.72 CN4.3 | v15.75,38.5 17,39.75 18.5,39.75 v19.25,40.5 | v19.75,23.5 12.25,23.5 v11.5,24.25
RXLED
  Top 0.305: LED2.C 16.57,29.03 16.57,29.49 17.95,30.86 17.95,32.35 18.86,33.26 18.86,35.58 18.5,36 13.72,36 13.72,41.38 U2.22
TXLED
  Top 0.305: LED1.C 11.54,29.03 11.54,29.38 12.46,30.29 12.46,31.77 11.2,33.03 9.6,33.03 9.37,33.26 9.37,36.92 13.03,40.58 13.03,41.38 U2.23

### Text on the board
tNames: GRN | FTDI | BLK | RH031.1 / Aug 2016 | 4x4 LED / Richard Hawthorn / richardhawthorn.com | or | LED / 3.3v | LED / VIN | LED / GND
tDocu: REG